# Altium project rpi_CM4_CAN_board.PrjPcb
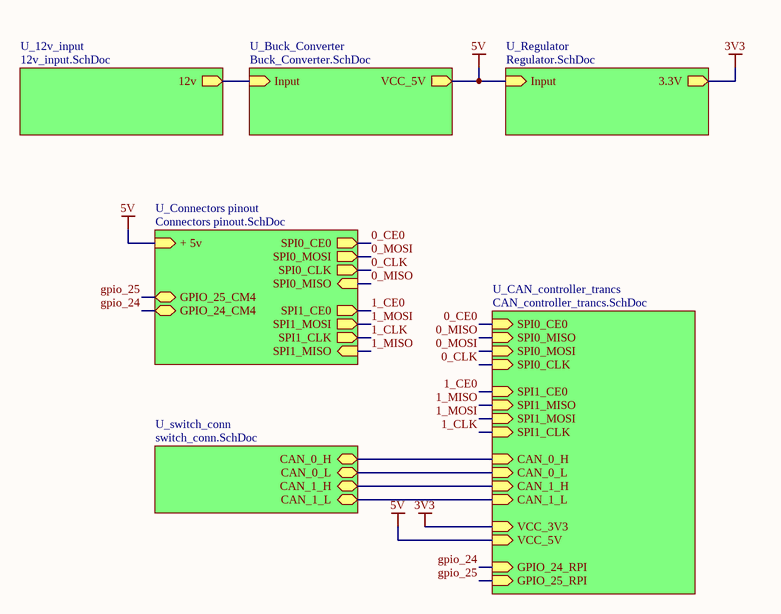
[diagram p0: schematic.SchDoc]
7 sheets, 59 parts. Net scope: hierarchical (ports join the sheet entries above them; power ports are global).
Board file: CM4_Single_Channel.PcbDoc
Sheets:
  schematic.SchDoc
    U_Buck_Converter = Buck_Converter.SchDoc
    U_12v_input = 12v_input.SchDoc
    U_switch_conn = switch_conn.SchDoc
    U_Regulator = Regulator.SchDoc
    U_CAN_controller_trancs = CAN_controller_trancs.SchDoc
    U_Connectors pinout = Connectors pinout.SchDoc

## Sheet schematic.SchDoc
size A; SheetNumber: 1; SheetTotal: 7

### Sub-sheets
U_12v_input = 12v_input.SchDoc: 12v (out)
U_Buck_Converter = Buck_Converter.SchDoc: Input (in), VCC_5V (out)
U_CAN_controller_trancs = CAN_controller_trancs.SchDoc: SPI0_CE0 (in), SPI0_MISO (in), SPI0_MOSI (in), SPI0_CLK (in), SPI1_CE0 (in), SPI1_MISO (in), SPI1_MOSI (in), SPI1_CLK (in), GPIO_25_RPI (in), CAN_0_H (in), CAN_0_L (in), CAN_1_H (in), CAN_1_L (in), GPIO_24_RPI (in), VCC_3V3 (in), VCC_5V (in)
U_Connectors pinout = Connectors pinout.SchDoc: + 5v (in), SPI0_CE0 (out), SPI1_CE0 (out), SPI1_MISO (in), SPI1_MOSI (out), SPI1_CLK (out), SPI0_MOSI (out), SPI0_CLK (out), SPI0_MISO (in), GPIO_25_CM4 (bidir), GPIO_24_CM4 (bidir)
U_Regulator = Regulator.SchDoc: Input (in), 3.3V (out)
U_switch_conn = switch_conn.SchDoc: CAN_0_H (bidir), CAN_0_L (bidir), CAN_1_H (bidir), CAN_1_L (bidir)

### Nets
3V3: sheet U_Regulator/3.3V, sheet U_CAN_controller_trancs/VCC_3V3
5V: sheet U_Buck_Converter/VCC_5V, sheet U_Regulator/Input, sheet U_CAN_controller_trancs/VCC_5V, sheet U_Connectors pinout/+ 5v
0_CE0: sheet U_CAN_controller_trancs/SPI0_CE0, sheet U_Connectors pinout/SPI0_CE0
0_CLK: sheet U_CAN_controller_trancs/SPI0_CLK, sheet U_Connectors pinout/SPI0_CLK
0_MISO: sheet U_CAN_controller_trancs/SPI0_MISO, sheet U_Connectors pinout/SPI0_MISO
0_MOSI: sheet U_CAN_controller_trancs/SPI0_MOSI, sheet U_Connectors pinout/SPI0_MOSI
1_CE0: sheet U_CAN_controller_trancs/SPI1_CE0, sheet U_Connectors pinout/SPI1_CE0
1_CLK: sheet U_CAN_controller_trancs/SPI1_CLK, sheet U_Connectors pinout/SPI1_CLK
1_MISO: sheet U_CAN_controller_trancs/SPI1_MISO, sheet U_Connectors pinout/SPI1_MISO
1_MOSI: sheet U_CAN_controller_trancs/SPI1_MOSI, sheet U_Connectors pinout/SPI1_MOSI
gpio_24: sheet U_CAN_controller_trancs/GPIO_24_RPI, sheet U_Connectors pinout/GPIO_24_CM4
gpio_25: sheet U_CAN_controller_trancs/GPIO_25_RPI, sheet U_Connectors pinout/GPIO_25_CM4
NetC2_2: sheet U_Buck_Converter/Input, sheet U_12v_input/12v
NetD4_1: sheet U_switch_conn/CAN_0_L, sheet U_CAN_controller_trancs/CAN_0_L
NetD4_2: sheet U_switch_conn/CAN_0_H, sheet U_CAN_controller_trancs/CAN_0_H
NetD5_1: sheet U_switch_conn/CAN_1_L, sheet U_CAN_controller_trancs/CAN_1_L
NetD5_2: sheet U_switch_conn/CAN_1_H, sheet U_CAN_controller_trancs/CAN_1_H

## Sheet Buck_Converter.SchDoc
size A; SheetNumber: 3; SheetTotal: 7
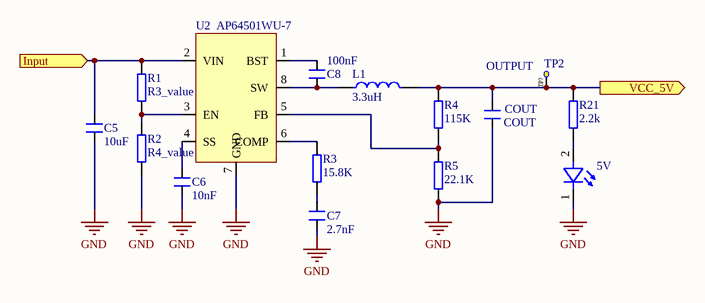
[diagram p1: Buck_Converter.SchDoc]

### Parts
5V  led  [LED_fp]  (value not drawn)
C5  10uF  [CAP_0805]
C6  10nF  [CAP_0805]
C7  2.7nF  [CAP_0805]
C8  100nF  [CAP_0805]
COUT  COUT  [CAP_0805]
L1  3.3uH  [SRN6045TA330M]
R1  R3_value  [RES0402]
R2  R4_value  [RES0402]
R3  15.8K  [RES0402]
R4  115K  [RES0402]
R5  22.1K  [RES0402]
R21  2.2k  [RES0402]
TP2  test_point  [Test_point]  (value not drawn)
U2  AP64501WU-7  [AP60501]

### Ports
Input (in, see schematic[2A]), VCC_5V (out, see schematic[3A], CAN_controller_trancs[2C])

### Nets
5V: COUT.2 L1.2 R4.2 R21.2 TP2.TP?(Test_Point) ; port VCC_5V
GND: 5V.1 C5.1 C6.1 C7.1 COUT.1 R2.1 R5.1 U2.7(GND)
Net5V_2: 5V.2 R21.1
NetC2_2: C5.2 R1.2 U2.2(VIN) ; port Input
NetC6_2: C6.2 U2.4(SS)
NetC7_2: C7.2 R3.1
NetC8_1: C8.1 L1.1 U2.8(SW)
NetC8_2: C8.2 U2.1(BST)
NetR1_1: R1.1 R2.2 U2.3(EN)
NetR3_2: R3.2 U2.6(COMP)
NetR4_1: R4.1 R5.2 U2.5(FB)

### Notes on the sheet
- OUTPUT

### Library data of the parts
5V = led: https://ro.farnell.com/wurth-elektronik/150080gs75000/led-0805-green-450mcd-520nm/dp/2322076?gross_price=true&CMP=KNC-GRO-GEN-SHOPPING-PMax_Test_840_MediumMargin&mckv=_dc%7Cpcrid%7C%7Cplid%7C%7Ckword%7C%7Cmatch%7C%7Cslid%7C%7Cproduct%7C2322076%7Cpgrid%7C%7Cptaid%7C%7C&gad_source=1&gclid=Cj0KCQjwjLGyBhCYARIsAPqTz18Amj4u5qMw452dzp4QFbvRWjaA25yZdq1iP5S9VaglDibMucql-VwaApB3EALw_wcB
C5-C8 COUT = CAP_0805
L1 = Inductor: SRN6045TA-3R3Y
R1-R5 R21 = RES 0402
U2 = AP64501WU-7: Manufacturer: Diodes; Manufacturer Part Number: AP64060WU-7; Supplier: Digikey; Supplier Part Number: 31-AP64060WU-7CT-ND; RoHS: No; Category: Voltage Regulators - Switching; Stock: 6070; Pricing: 1=0.62, 10=0.531, 25=0.496, 100=0.3968, 250=0.36844, 500=0.31174, 1000=0.2409 (USD)

## Sheet 12v_input.SchDoc
size A; SheetNumber: 2; SheetTotal: 7
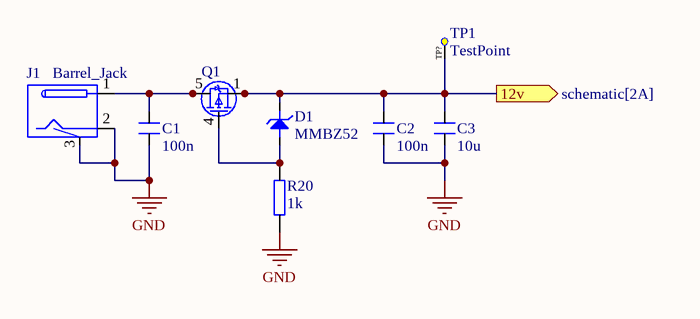
[diagram p2: 12v_input.SchDoc]

### Parts
C1  100n  [CAP_0805]
C2  100n  [CAP_0805]
C3  10u  [CAP_0805]
D1  MMBZ52  [MMBZ52]
J1  Barrel_Jack  [power jack]
Q1  Q1  [DMP3036SFV7]  (value not drawn)
R20  1k  [RES0402]
TP1  TestPoint  [Test_point]

### Ports
12v (out, see schematic[2A])

### Nets
GND: C1.1 C2.1 C3.1 J1.2 J1.3 R20.1
NetC1_2: C1.2 J1.1 Q1.5 Q1.6 Q1.7 Q1.8 Q1.9
NetC2_2: C2.2 C3.2 D1.3(Cathode) Q1.1 Q1.2 Q1.3 TP1.TP?(Test_Point) ; port 12v
NetD1_1: D1.1(Anode) Q1.4 R20.2

### Library data of the parts
C1-C3 = CAP_0805
R20 = RES 0402
TP1 = test_point

## Sheet switch_conn.SchDoc
size A; SheetNumber: 7; SheetTotal: 7
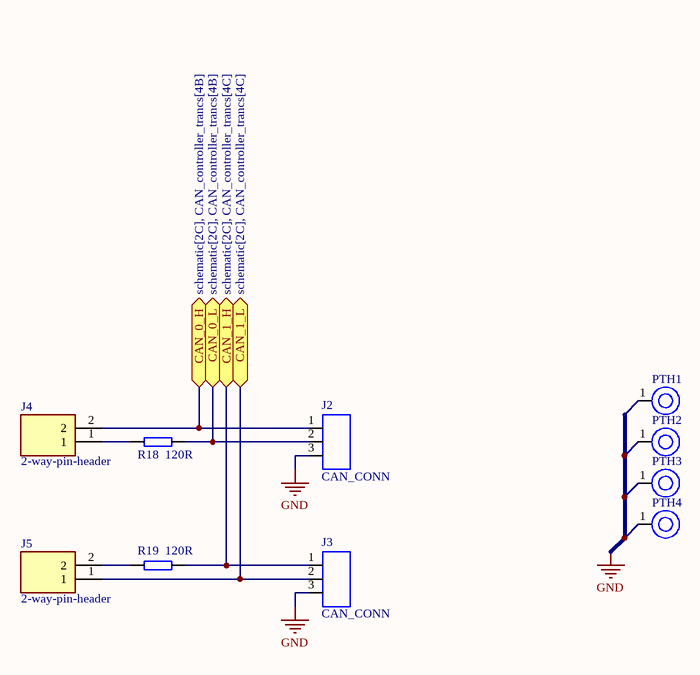
[diagram p3: switch_conn.SchDoc]

### Parts
J2  CAN_CONN  [Terminal]
J3  CAN_CONN  [Terminal]
J4  2-way-pin-header  [HDRV2W66P0X254_1X2_508X249X1067P]
J5  2-way-pin-header  [HDRV2W66P0X254_1X2_508X249X1067P]
PTH1  PTH?  [mh_fp]  (value not drawn)
PTH2  PTH?  [mh_fp]  (value not drawn)
PTH3  PTH?  [mh_fp]  (value not drawn)
PTH4  PTH?  [mh_fp]  (value not drawn)
R18  120R  [RES0402]
R19  120R  [RES0402]

### Ports
CAN_0_H (bidir, see schematic[2C], CAN_controller_trancs[4B]), CAN_0_L (bidir, see schematic[2C], CAN_controller_trancs[4B]), CAN_1_H (bidir, see schematic[2C], CAN_controller_trancs[4C]), CAN_1_L (bidir, see schematic[2C], CAN_controller_trancs[4C])

### Nets
GND: J2.3 J3.3 PTH1.1 PTH2.1 PTH3.1 PTH4.1
NetD4_1: J2.2 R18.1 ; port CAN_0_L
NetD4_2: J2.1(CAN_H) J4.2 ; port CAN_0_H
NetD5_1: J3.2 J5.1 ; port CAN_1_L
NetD5_2: J3.1(CAN_H) R19.1 ; port CAN_1_H
NetJ4_1: J4.1 R18.2
NetJ5_2: J5.2 R19.2

### Library data of the parts
PTH1-PTH4 = PTH?: Mounting Hole, 2.5mm
R18 R19 = RES 0402

## Sheet Regulator.SchDoc
size A; SheetNumber: 4; SheetTotal: 7
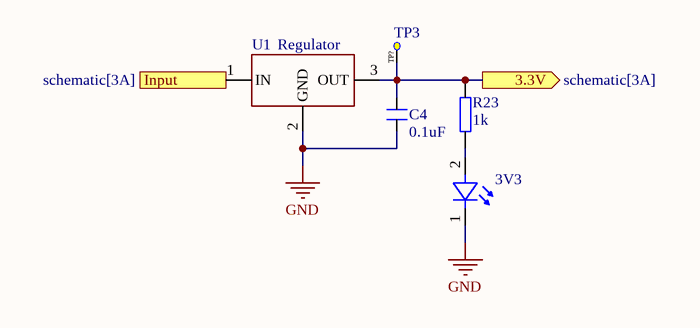
[diagram p4: Regulator.SchDoc]

### Parts
3V3  led  [LED_fp]  (value not drawn)
C4  0.1uF  [CAP_0805]
R23  1k  [RES0402]
TP3  test_point  [Test_point]  (value not drawn)
U1  Regulator  [TC1108]

### Ports
3.3V (out, see schematic[3A]), Input (in, see schematic[3A])

### Nets
3V3: C4.2 R23.2 TP3.TP?(Test_Point) U1.3(OUT) ; port 3.3V
5V: U1.1(IN) ; port Input
GND: 3V3.1 C4.1 U1.2(GND)
Net3V3_2: 3V3.2 R23.1

### Library data of the parts
C4 = CAP_0805
R23 = RES 0402
U1 = Regulator: CJ117 or TC1108

## Sheet CAN_controller_trancs.SchDoc
size A; SheetNumber: 6; SheetTotal: 7
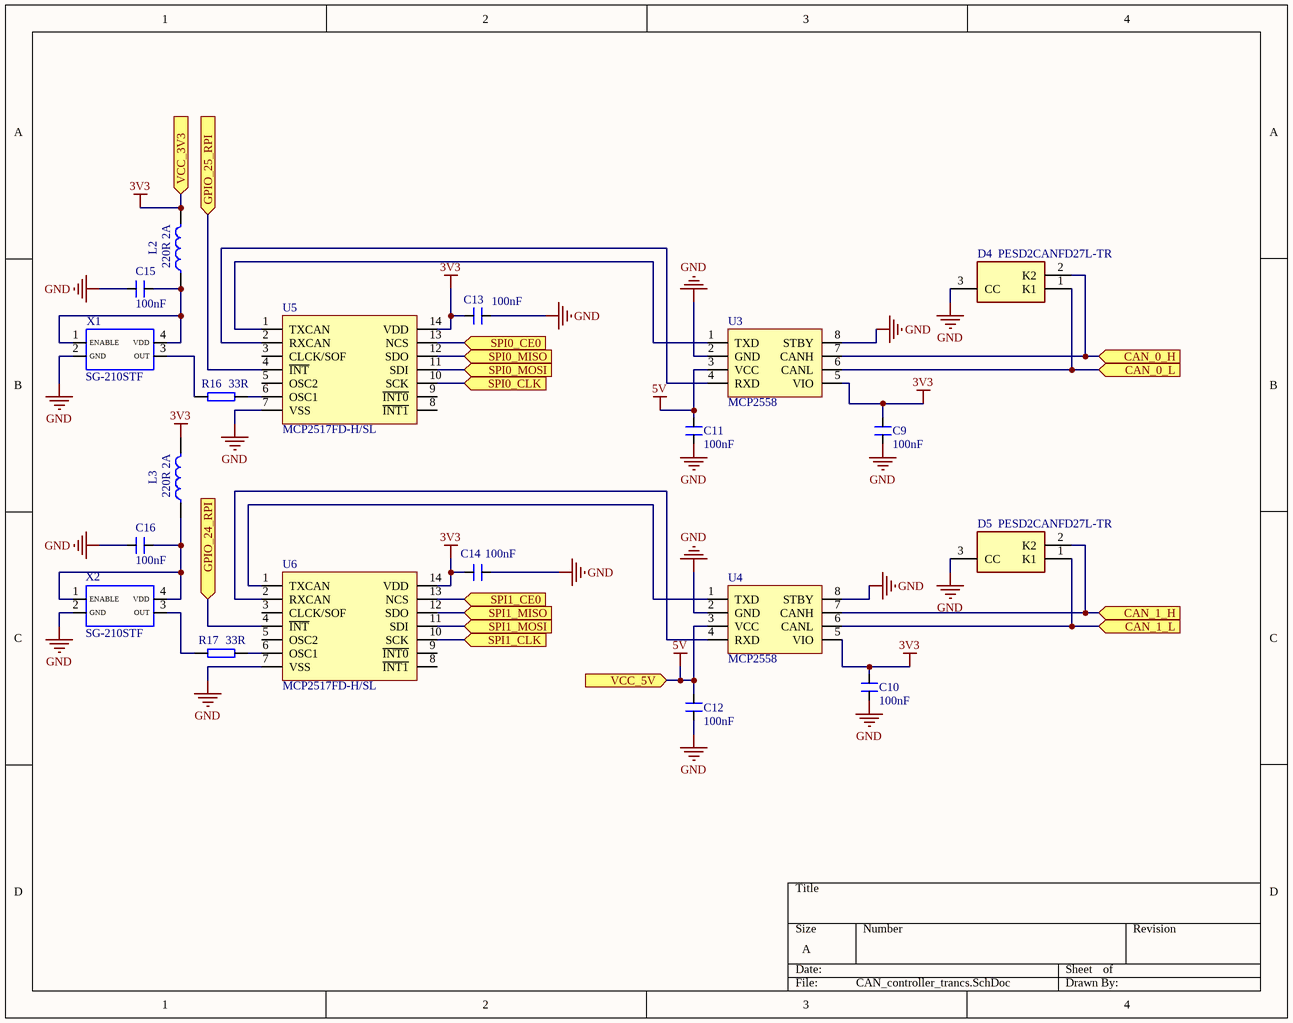
[diagram p5: CAN_controller_trancs.SchDoc]

### Parts
C9  100nF  [CAP_0805]
C10  100nF  [CAP_0805]
C11  100nF  [CAP_0805]
C12  100nF  [CAP_0805]
C13  100nF  [CAP_0805]
C14  100nF  [CAP_0805]
C15  100nF  [CAP_0805]
C16  100nF  [CAP_0805]
D4  PESD2CANFD27L-TR  [SOT95P230X110-3N]
D5  PESD2CANFD27L-TR  [SOT95P230X110-3N]
L2  220R 2A  [L_0805]
L3  220R 2A  [L_0805]
R16  33R  [RES0402]
R17  33R  [RES0402]
U3  MCP2558  [MCP2557_SOIC8]
U4  MCP2558  [MCP2557_SOIC8]
U5  MCP2517FD-H/SL  [MCP2517FD_SOIC14]
U6  MCP2517FD-H/SL  [MCP2517FD_SOIC14]
X1  SG-210STF  [Osc]
X2  SG-210STF  [Osc]

### Ports
CAN_0_H (in, see schematic[3C], switch_conn[2B]), CAN_0_L (in, see schematic[3C], switch_conn[2B]), CAN_1_H (in, see schematic[3C], switch_conn[2B]), CAN_1_L (in, see schematic[3C], switch_conn[2B]), GPIO_24_RPI (in, see schematic[3C]), GPIO_25_RPI (in, see schematic[3C]), SPI0_CE0 (in, see schematic[3B], Connectors pinout[1B]), SPI0_CLK (in, see schematic[3B], Connectors pinout[2B]), SPI0_MISO (in, see schematic[3B], Connectors pinout[2B]), SPI0_MOSI (in, see schematic[3B], Connectors pinout[2B]), SPI1_CE0 (in, see schematic[3B], Connectors pinout[1B]), SPI1_CLK (in, see schematic[3B], Connectors pinout[1B]), SPI1_MISO (in, see schematic[3B], Connectors pinout[2B]), SPI1_MOSI (in, see schematic[3B], Connectors pinout[1B]), VCC_3V3 (in, see schematic[3C]), VCC_5V (in, see schematic[3C], Buck_Converter[3B])

### Nets
3V3: C9.2 C10.2 C13.1 C14.1 L2.2 L3.2 U3.5(VIO) U4.5(VIO) U5.14(VDD) U6.14(VDD) ; port VCC_3V3
5V: C11.2 C12.2 U3.3(VCC) U4.3(VCC) ; port VCC_5V
GND: C9.1 C10.1 C11.1 C12.1 C13.2 C14.2 C15.2 C16.2 D4.3(CC) D5.3(CC) U3.2(GND) U3.8(STBY) U4.2(GND) U4.8(STBY) U5.7(VSS) U6.7(VSS) X1.2(GND) X2.2(GND)
0_CE0: U5.13(NCS) ; port SPI0_CE0
0_CLK: U5.10(SCK) ; port SPI0_CLK
0_MISO: U5.12(SDO) ; port SPI0_MISO
0_MOSI: U5.11(SDI) ; port SPI0_MOSI
1_CE0: U6.13(NCS) ; port SPI1_CE0
1_CLK: U6.10(SCK) ; port SPI1_CLK
1_MISO: U6.12(SDO) ; port SPI1_MISO
1_MOSI: U6.11(SDI) ; port SPI1_MOSI
gpio_24: U6.4(~{INT}) ; port GPIO_24_RPI
gpio_25: U5.4(~{INT}) ; port GPIO_25_RPI
NetC15_1: C15.1 L2.1 X1.1(ENABLE) X1.4(VDD)
NetC16_1: C16.1 L3.1 X2.1(ENABLE) X2.4(VDD)
NetD4_1: D4.1(K1) U3.6(CANL) ; port CAN_0_L
NetD4_2: D4.2(K2) U3.7(CANH) ; port CAN_0_H
NetD5_1: D5.1(K1) U4.6(CANL) ; port CAN_1_L
NetD5_2: D5.2(K2) U4.7(CANH) ; port CAN_1_H
NetR16_1: R16.1 X1.3(OUT)
NetR16_2: R16.2 U5.6(OSC1)
NetR17_1: R17.1 X2.3(OUT)
NetR17_2: R17.2 U6.6(OSC1)
NetU3_1: U3.1(TXD) U5.1(TXCAN)
NetU3_4: U3.4(RXD) U5.2(RXCAN)
NetU4_1: U4.1(TXD) U6.1(TXCAN)
NetU4_4: U4.4(RXD) U6.2(RXCAN)

Not connected (* = marked no-connect by the designer): U5 3(CLCK/SOF) 5(OSC2) 8(~{INT1}) 9(~{INT0}); U6 3(CLCK/SOF) 5(OSC2) 8(~{INT1}) 9(~{INT0})

### Library data of the parts
C9-C16 = CAP_0805
D4 D5 = PESD2CANFD27L-TR: Diode; Manufacturer_Name: Nexperia; Datasheet Link: https://assets.nexperia.com/documents/data-sheet/PESD2CANFD27L-T.pdf; Height: 1.1mm; Manufacturer_Part_Number: PESD2CANFD27L-TR; Mouser Part Number: 771-PESD2CANFD27L-TR; Mouser Price/Stock: https://www.mouser.co.uk/ProductDetail/Nexperia/PESD2CANFD27L-TR?qs=hWgE7mdIu5THSw1DtVHdDg%3D%3D
L2 L3 = Inductor
R16 R17 = RES 0402

## Sheet Connectors pinout.SchDoc
size A; SheetNumber: 5; SheetTotal: 7
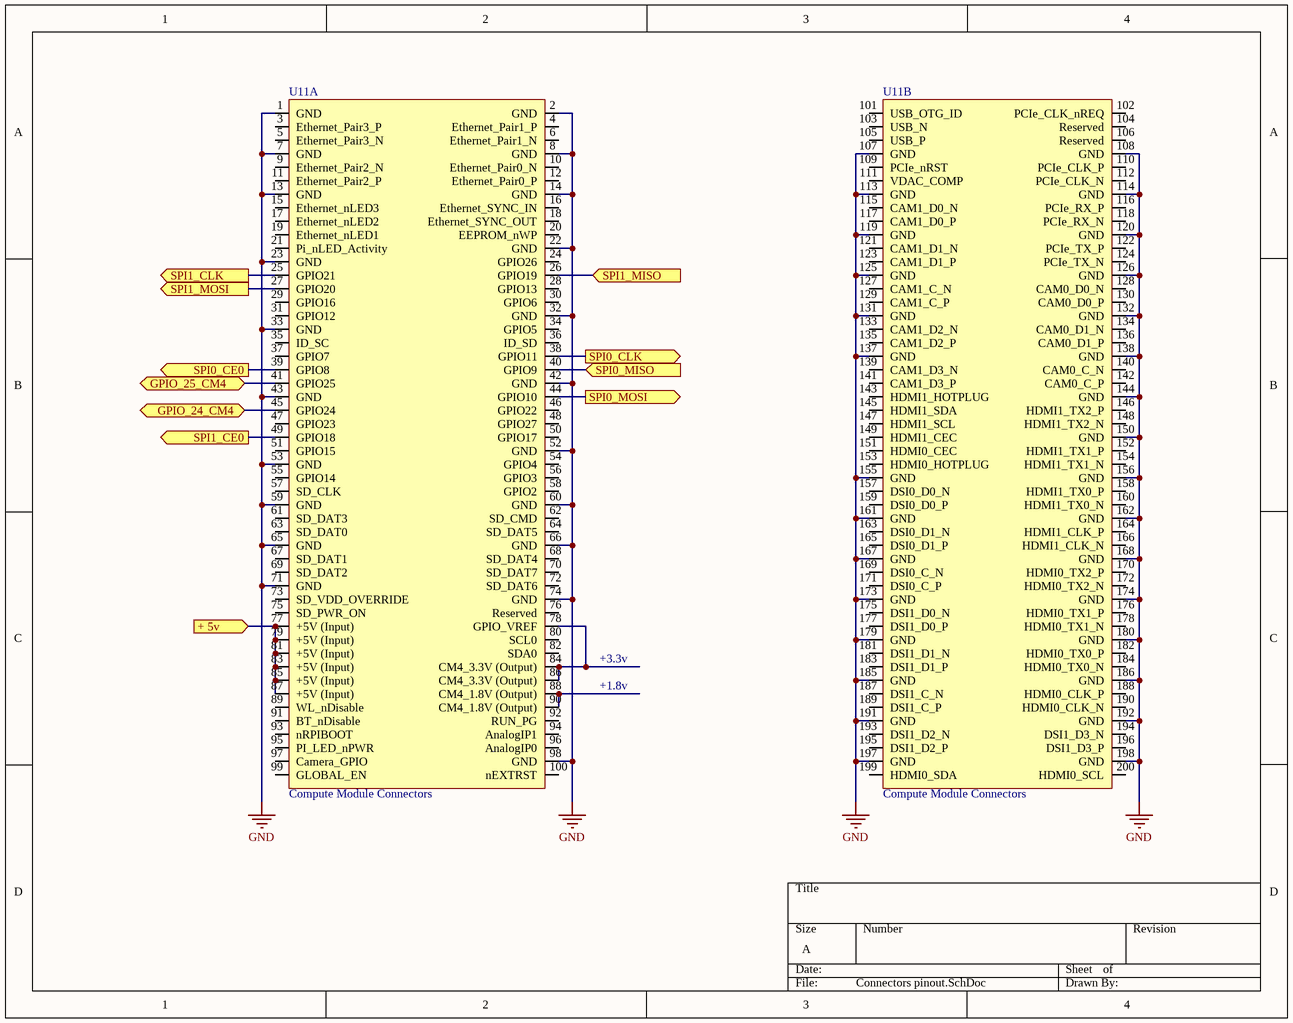
[diagram p6: Connectors pinout.SchDoc]

### Parts
U11  Compute Module Connectors  [CM4-DF40HC(3.0)-100DS-0.4v_3mm_1.5mm_NO_Outline-3D]  (parts A,B of 2)

### Ports
+ 5v (in, see schematic[2B]), GPIO_24_CM4 (bidir, see schematic[2B]), GPIO_25_CM4 (bidir, see schematic[2B]), SPI0_CE0 (out, see schematic[2B], CAN_controller_trancs[2B]), SPI0_CLK (out, see schematic[2B], CAN_controller_trancs[2B]), SPI0_MISO (in, see schematic[2B], CAN_controller_trancs[2B]), SPI0_MOSI (out, see schematic[2B], CAN_controller_trancs[2B]), SPI1_CE0 (out, see schematic[2B], CAN_controller_trancs[2C]), SPI1_CLK (out, see schematic[2B], CAN_controller_trancs[2C]), SPI1_MISO (in, see schematic[2B], CAN_controller_trancs[2C]), SPI1_MOSI (out, see schematic[2B], CAN_controller_trancs[2C])

### Nets
5V: U11.77(+5V_(Input)) U11.79(+5V_(Input)) U11.81(+5V_(Input)) U11.83(+5V_(Input)) U11.85(+5V_(Input)) U11.87(+5V_(Input)) ; port + 5v
GND: U11.1(GND) U11.2(GND) U11.7(GND) U11.8(GND) U11.13(GND) U11.14(GND) U11.22(GND) U11.23(GND) U11.32(GND) U11.33(GND) U11.42(GND) U11.43(GND) U11.52(GND) U11.53(GND) U11.59(GND) U11.60(GND) U11.65(GND) U11.66(GND) U11.71(GND) U11.74(GND) U11.98(GND) U11.107(GND) U11.108(GND) U11.113(GND) U11.114(GND) U11.119(GND) U11.120(GND) U11.125(GND) U11.126(GND) U11.131(GND) U11.132(GND) U11.137(GND) U11.138(GND) U11.144(GND) U11.150(GND) U11.155(GND) U11.156(GND) U11.161(GND) U11.162(GND) U11.167(GND) U11.168(GND) U11.173(GND) U11.174(GND) U11.179(GND) U11.180(GND) U11.185(GND) U11.186(GND) U11.191(GND) U11.192(GND) U11.197(GND) U11.198(GND)
0_CE0: U11.39(GPIO8) ; port SPI0_CE0
0_CLK: U11.38(GPIO11) ; port SPI0_CLK
0_MISO: U11.40(GPIO9) ; port SPI0_MISO
0_MOSI: U11.44(GPIO10) ; port SPI0_MOSI
1_CE0: U11.49(GPIO18) ; port SPI1_CE0
1_CLK: U11.25(GPIO21) ; port SPI1_CLK
1_MISO: U11.26(GPIO19) ; port SPI1_MISO
1_MOSI: U11.27(GPIO20) ; port SPI1_MOSI
gpio_24: U11.45(GPIO24) ; port GPIO_24_CM4
gpio_25: U11.41(GPIO25) ; port GPIO_25_CM4
NetU11_78: U11.78(GPIO_VREF) U11.84(CM4_3.3V_(Output)) U11.86(CM4_3.3V_(Output))
NetU11_88: U11.88(CM4_1.8V_(Output)) U11.90(CM4_1.8V_(Output))

Not connected (* = marked no-connect by the designer): U11 3(Ethernet_Pair3_P) 4(Ethernet_Pair1_P) 5(Ethernet_Pair3_N) 6(Ethernet_Pair1_N) 9(Ethernet_Pair2_N) 10(Ethernet_Pair0_N) 11(Ethernet_Pair2_P) 12(Ethernet_Pair0_P) 15(Ethernet_nLED3) 16(Ethernet_SYNC_IN) 17(Ethernet_nLED2) 18(Ethernet_SYNC_OUT) 19(Ethernet_nLED1) 20(EEPROM_nWP) 21(Pi_nLED_Activity) 24(GPIO26) 28(GPIO13) 29(GPIO16) 30(GPIO6) 31(GPIO12) 34(GPIO5) 35(ID_SC) 36(ID_SD) 37(GPIO7) 46(GPIO22) 47(GPIO23) 48(GPIO27) 50(GPIO17) 51(GPIO15) 54(GPIO4) 55(GPIO14) 56(GPIO3) 57(SD_CLK) 58(GPIO2) 61(SD_DAT3) 62(SD_CMD) 63(SD_DAT0) 64(SD_DAT5) 67(SD_DAT1) 68(SD_DAT4) 69(SD_DAT2) 70(SD_DAT7) 72(SD_DAT6) 73(SD_VDD_OVERRIDE) 75(SD_PWR_ON) 76(Reserved) 80(SCL0) 82(SDA0) 89(WL_nDisable) 91(BT_nDisable) 92(RUN_PG) 93(nRPIBOOT) 94(AnalogIP1) 95(PI_LED_nPWR) 96(AnalogIP0) 97(Camera_GPIO) 99(GLOBAL_EN) 100(nEXTRST) 101(USB_OTG_ID) 102(PCIe_CLK_nREQ) 103(USB_N) 104(Reserved) 105(USB_P) 106(Reserved) 109(PCIe_nRST) 110(PCIe_CLK_P) 111(VDAC_COMP) 112(PCIe_CLK_N) 115(CAM1_D0_N) 116(PCIe_RX_P) 117(CAM1_D0_P) 118(PCIe_RX_N) 121(CAM1_D1_N) 122(PCIe_TX_P) 123(CAM1_D1_P) 124(PCIe_TX_N) 127(CAM1_C_N) 128(CAM0_D0_N) 129(CAM1_C_P) 130(CAM0_D0_P) 133(CAM1_D2_N) 134(CAM0_D1_N) 135(CAM1_D2_P) 136(CAM0_D1_P) 139(CAM1_D3_N) 140(CAM0_C_N) 141(CAM1_D3_P) 142(CAM0_C_P) 143(HDMI1_HOTPLUG) 145(HDMI1_SDA) 146(HDMI1_TX2_P) 147(HDMI1_SCL) 148(HDMI1_TX2_N) 149(HDMI1_CEC) 151(HDMI0_CEC) 152(HDMI1_TX1_P) 153(HDMI0_HOTPLUG) 154(HDMI1_TX1_N) 157(DSI0_D0_N) 158(HDMI1_TX0_P) 159(DSI0_D0_P) 160(HDMI1_TX0_N) 163(DSI0_D1_N) 164(HDMI1_CLK_P) 165(DSI0_D1_P) 166(HDMI1_CLK_N) 169(DSI0_C_N) 170(HDMI0_TX2_P) 171(DSI0_C_P) 172(HDMI0_TX2_N) 175(DSI1_D0_N) 176(HDMI0_TX1_P) 177(DSI1_D0_P) 178(HDMI0_TX1_N) 181(DSI1_D1_N) 182(HDMI0_TX0_P) 183(DSI1_D1_P) 184(HDMI0_TX0_N) 187(DSI1_C_N) 188(HDMI0_CLK_P) 189(DSI1_C_P) 190(HDMI0_CLK_N) 193(DSI1_D2_N) 194(DSI1_D3_N) 195(DSI1_D2_P) 196(DSI1_D3_P) 199(HDMI0_SDA) 200(HDMI0_SCL)

### Notes on the sheet
- +1.8v
- +3.3v

## Nets that join several sheets
3V3: Regulator (C4.2 R23.2 TP3.TP? U1.3), CAN_controller_trancs (10 pins)
5V: Buck_Converter (5 pins), Regulator (U1.1), CAN_controller_trancs (C11.2 C12.2 U3.3 U4.3), Connectors pinout (6 pins)
GND: Buck_Converter (8 pins), 12v_input (6 pins), switch_conn (6 pins), Regulator (3V3.1 C4.1 U1.2), CAN_controller_trancs (18 pins), Connectors pinout (51 pins)
0_CE0: CAN_controller_trancs (U5.13), Connectors pinout (U11.39)
0_CLK: CAN_controller_trancs (U5.10), Connectors pinout (U11.38)
0_MISO: CAN_controller_trancs (U5.12), Connectors pinout (U11.40)
0_MOSI: CAN_controller_trancs (U5.11), Connectors pinout (U11.44)
1_CE0: CAN_controller_trancs (U6.13), Connectors pinout (U11.49)
1_CLK: CAN_controller_trancs (U6.10), Connectors pinout (U11.25)
1_MISO: CAN_controller_trancs (U6.12), Connectors pinout (U11.26)
1_MOSI: CAN_controller_trancs (U6.11), Connectors pinout (U11.27)
gpio_24: CAN_controller_trancs (U6.4), Connectors pinout (U11.45)
gpio_25: CAN_controller_trancs (U5.4), Connectors pinout (U11.41)
NetC2_2: Buck_Converter (C5.2 R1.2 U2.2), 12v_input (7 pins)
NetD4_1: switch_conn (J2.2 R18.1), CAN_controller_trancs (D4.1 U3.6)
NetD4_2: switch_conn (J2.1 J4.2), CAN_controller_trancs (D4.2 U3.7)
NetD5_1: switch_conn (J3.2 J5.1), CAN_controller_trancs (D5.1 U4.6)
NetD5_2: switch_conn (J3.1 R19.1), CAN_controller_trancs (D5.2 U4.7)